# Altium schematic sheet 105358-3SC001-01-A_BlockDiagram.SchDoc: Block Diagram
size 420 x 297 mm; DrawnBy: JeSa , KaKa; Organization: Hotswap Norden AB; Address1: Knarrarnäsgatan 7; Address2: SE-164 40 Kista; Address3: Sweden; DocumentNumber: 105358-3SC001-01; SheetNumber: 2; SheetTotal: 5; PageSetup: Record=PageOptions|CenterHorizontal=True|CenterVertical=True|PrintScale=0.96|XCorrection=1.00|YCorrection=1.00|PrintKind=0|BorderSize=5000000|LeftOffset=0|BottomOffset=0|Orientation=2|PaperLength=1000|PaperWidth=1000|Scale=100|PaperSource=7|PrintQuality=-4|MediaType=1|DitherType=10|PaperKind=A3|PrintScaleMode=1
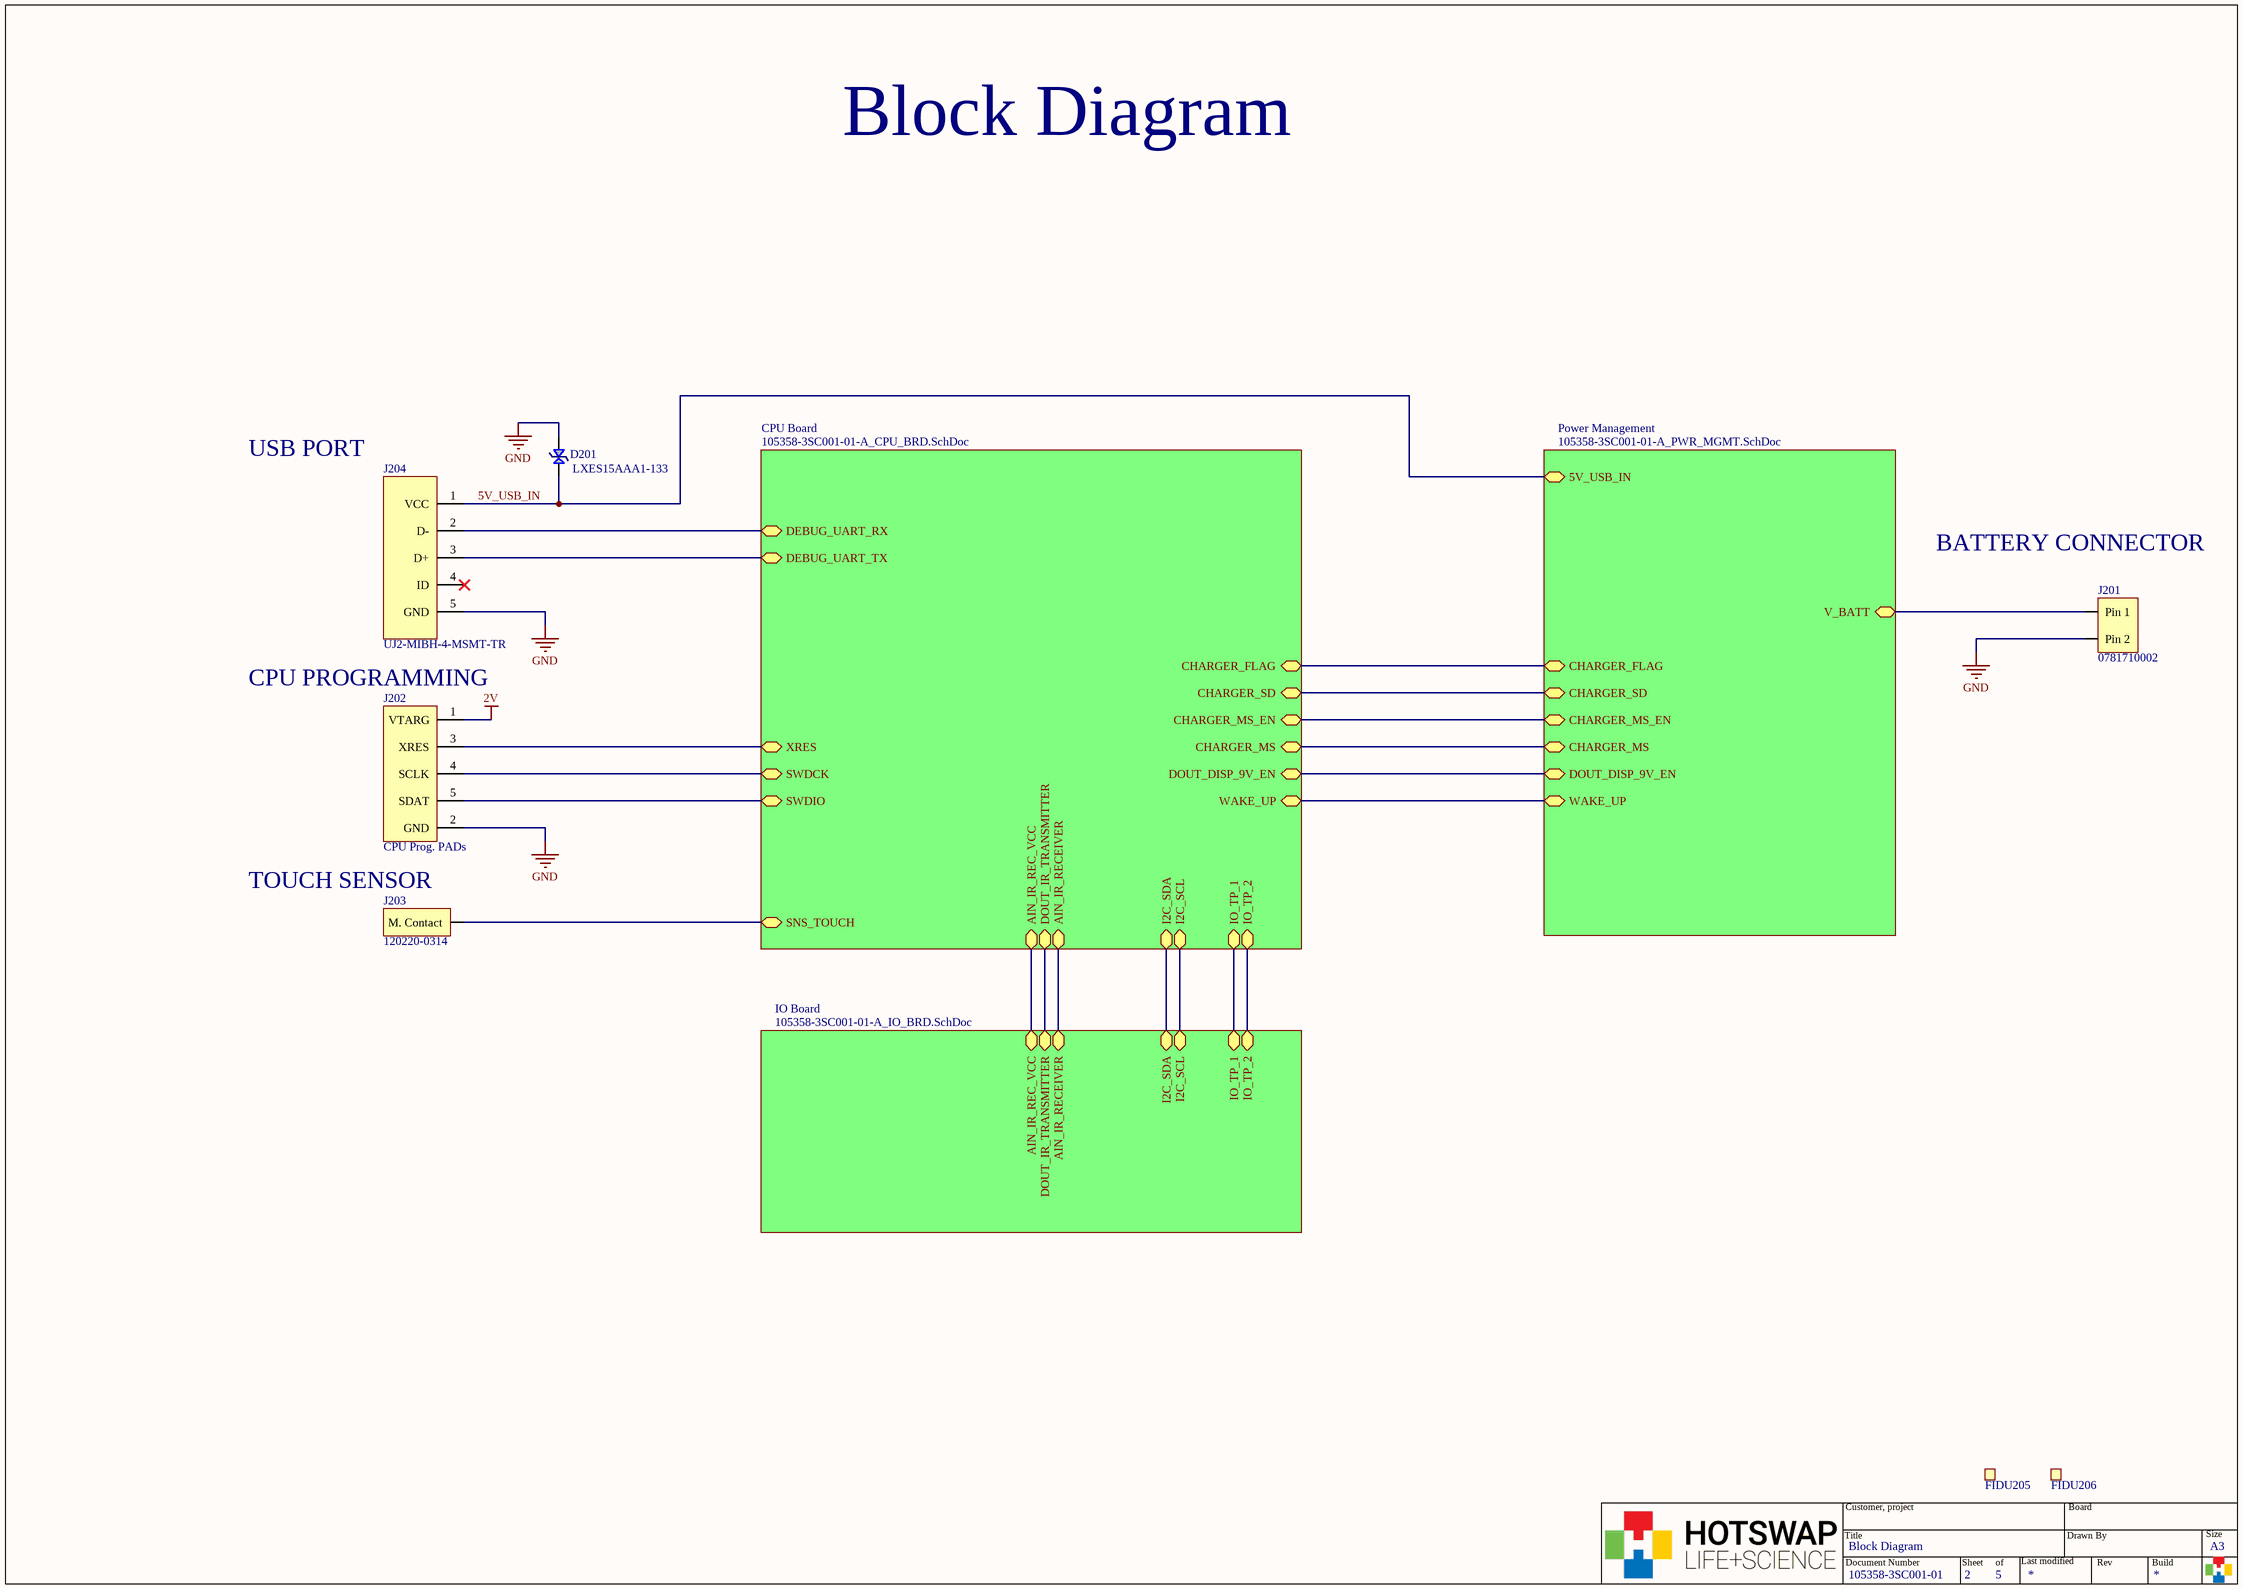
[diagram p0: 105358-3SC001-01-A_BlockDiagram.SchDoc]

## Parts
D201  LXES15AAA1-133  [0402C-GENERIC]
FIDU205  FIDU-SQUARE  [FIDU-SQUARE]  (value not drawn)  (no BOM)
FIDU206  FIDU-SQUARE  [FIDU-SQUARE]  (value not drawn)  (no BOM)
J201  0781710002  [PAD 0781710002]
J202  CPU Prog. PADs  [PAD PROGRAMMING]  (no BOM)
J203  120220-0314  [PAD 1.0x1.95mm]
J204  UJ2-MIBH-4-MSMT-TR  [UJ2-MIBH-4-MSMT-TR]

## Sub-sheets
CPU Board = 105358-3SC001-01-A_CPU_BRD.SchDoc: DEBUG_UART_TX, CHARGER_FLAG, DEBUG_UART_RX, CHARGER_MS, CHARGER_SD, CHARGER_MS_EN, WAKE_UP, DOUT_DISP_9V_EN, XRES, SWDCK, SWDIO, AIN_IR_REC_VCC, AIN_IR_RECEIVER, DOUT_IR_TRANSMITTER, I2C_SDA, I2C_SCL, IO_TP_1, IO_TP_2, SNS_TOUCH
IO Board = 105358-3SC001-01-A_IO_BRD.SchDoc: AIN_IR_REC_VCC, AIN_IR_RECEIVER, DOUT_IR_TRANSMITTER, I2C_SDA, I2C_SCL, IO_TP_1, IO_TP_2
Power Management = 105358-3SC001-01-A_PWR_MGMT.SchDoc: CHARGER_FLAG, CHARGER_MS_EN, CHARGER_SD, CHARGER_MS, WAKE_UP, DOUT_DISP_9V_EN, 5V_USB_IN, V_BATT

## Nets
2V: J202.1(VTARG)
GND: D201.1 J201.2(Pin_2) J202.2(GND) J204.5(GND)
5V_USB_IN: D201.2 J204.1(VCC) ; sheet Power Management/5V_USB_IN
NetJ201_1: J201.1(Pin_1) ; sheet Power Management/V_BATT
NetJ202_3: J202.3(XRES) ; sheet CPU Board/XRES
NetJ202_4: J202.4(SCLK) ; sheet CPU Board/SWDCK
NetJ202_5: J202.5(SDAT) ; sheet CPU Board/SWDIO
NetJ203_1: J203.1(M._Contact) ; sheet CPU Board/SNS_TOUCH
NetJ204_2: J204.2(D-) ; sheet CPU Board/DEBUG_UART_RX
NetJ204_3: J204.3(D+) ; sheet CPU Board/DEBUG_UART_TX
(unnamed): sheet Power Management/CHARGER_FLAG, sheet CPU Board/CHARGER_FLAG
(unnamed): sheet Power Management/CHARGER_MS_EN, sheet CPU Board/CHARGER_MS_EN
(unnamed): sheet Power Management/CHARGER_SD, sheet CPU Board/CHARGER_SD
(unnamed): sheet Power Management/CHARGER_MS, sheet CPU Board/CHARGER_MS
(unnamed): sheet Power Management/WAKE_UP, sheet CPU Board/WAKE_UP
(unnamed): sheet Power Management/DOUT_DISP_9V_EN, sheet CPU Board/DOUT_DISP_9V_EN
(unnamed): sheet CPU Board/AIN_IR_REC_VCC, sheet IO Board/AIN_IR_REC_VCC
(unnamed): sheet CPU Board/AIN_IR_RECEIVER, sheet IO Board/AIN_IR_RECEIVER
(unnamed): sheet CPU Board/DOUT_IR_TRANSMITTER, sheet IO Board/DOUT_IR_TRANSMITTER
(unnamed): sheet CPU Board/I2C_SDA, sheet IO Board/I2C_SDA
(unnamed): sheet CPU Board/I2C_SCL, sheet IO Board/I2C_SCL
(unnamed): sheet CPU Board/IO_TP_1, sheet IO Board/IO_TP_1
(unnamed): sheet CPU Board/IO_TP_2, sheet IO Board/IO_TP_2

Not connected (* = marked no-connect by the designer): J204 4(ID)*

## Notes on the sheet
- Block Diagram
- USB PORT
- BATTERY CONNECTOR
- (near J202) CPU PROGRAMMING
- TOUCH SENSOR
- Title
- Customer, project
- Drawn By
- Board
- Size
- Document Number
- Sheet
- of
- Last modified
- Rev
- Build
- A3

## Library data of the parts
D201 = TVS DIODE 15VWM 0402: Manufacturer: Murata Electronics North America; Type: Zener; Capacitance @ Frequency: 0.05pF @ 1MHz; Voltage - Reverse Standoff (Typ): 15V; Manufacturer Part Number: LXES15AAA1-133; Digi-Key Part Number: 490-13209-1-ND; PackageReference: 0402
FIDU205 FIDU206 = FIDU-SQUARE: Feducial marker Square; ClassName: FIDU
J201 = CONNECTOR 1.20MM WTB HEADER VERT 2POS: 1.20MM WTB HEADER VERT 2POS; Manufacturer: Molex, LLC; ComponentLink1URL: http://www.molex.com/pdm_docs/sd/781710002_sd.pdf; ComponentLink1Description: Datasheet; Manufacturer Part Number: 0781710002; Mounting Type: Surface Mount; Digi-Key Part Number: WM4459CT-ND
J202 = PROGRAMMING PADS: CPU Programming PADs
J203 = MICRO UNIVERSAL CONTACT Z 3.5MM: Manufacturer: ITT Cannon, LLC; ComponentLink1URL: https://media.digikey.com/pdf/Data%20Sheets/ITT%20PDFs/120220-0314_Dwg.pdf; ComponentLink1Description: Datasheet; Manufacturer Part Number: 120220-0314; Mounting Type: Surface Mount; Digi-Key Part Number: 1003-2383-1-ND
J204 = UJ2-MIBH-4-MSMT-TR: USB Micro B; Manufacturer: CUI Inc.; Specifications: USB 2.0; Current Rating: 0.5A, 1.8A; Voltage - Rated: 30VAC; Shielding: Shielded; Number of Contacts: 5; Gender: Receptacle; ComponentLink1URL: http://www.cui.com/product/resource/uj2-mibh-4-msmt.pdf; ComponentLink1Description: Datasheet; Manufacturer Part Number: UJ2-MIBH-4-MSMT-TR; Type: USB - micro B; Digi-Key Part Number: 102-4008-1-ND; Contact Finish: Gold